# Altium schematic sheet MicroSDCard.SchDoc
size A4; Revision: C.2(PCB.SCH)
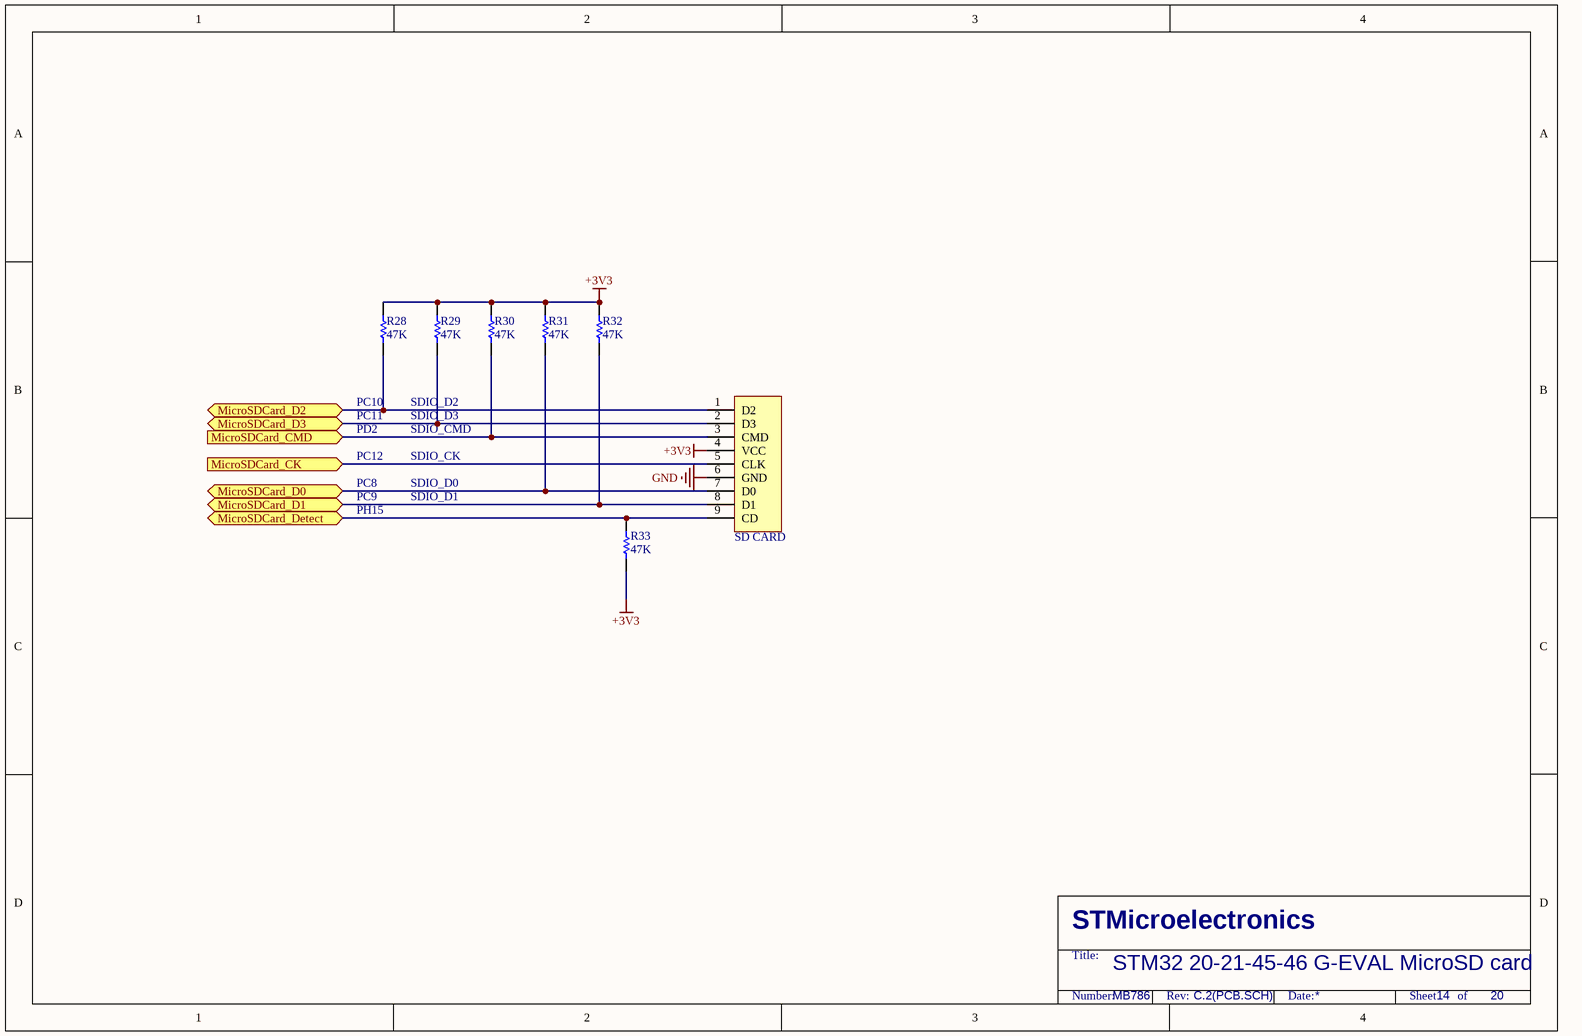
[diagram p0: MicroSDCard.SchDoc]

## Parts
R28  47K  [0603_R]
R29  47K  [0603_R]
R30  47K  [0603_R]
R31  47K  [0603_R]
R32  47K  [0603_R]
R33  47K  [0603_R]
SD_CARD  SD_Card_TF  [SD_Card_TF]  (value not drawn)

## Ports
MicroSDCard_CK (in), MicroSDCard_CMD (in), MicroSDCard_D0 (bidir), MicroSDCard_D1 (bidir), MicroSDCard_D2 (bidir), MicroSDCard_D3 (bidir), MicroSDCard_Detect

## Nets
+3V3: R28.1 R29.1 R30.1 R31.1 R32.1 R33.2 SD_CARD.4(VCC)
GND: SD_CARD.6(GND)
MicroSDCard_CK: SD_CARD.5(CLK) ; port MicroSDCard_CK
MicroSDCard_CMD: R30.2 SD_CARD.3(CMD) ; port MicroSDCard_CMD
MicroSDCard_D0: R31.2 SD_CARD.7(D0) ; port MicroSDCard_D0
MicroSDCard_D1: R32.2 SD_CARD.8(D1) ; port MicroSDCard_D1
MicroSDCard_D2: R28.2 SD_CARD.1(D2) ; port MicroSDCard_D2
MicroSDCard_D3: R29.2 SD_CARD.2(D3) ; port MicroSDCard_D3
MicroSDCard_Detect: R33.1 SD_CARD.9(CD) ; port MicroSDCard_Detect

## Notes on the sheet
- PC10
- PC11
- PD2
- SDIO_CMD
- SDIO_D3
- SDIO_D2
- PC8
- PC9
- PC12
- PH15
- SDIO_D1
- SDIO_D0
- SDIO_CK
- STM32 20-21-45-46 G-EVAL MicroSD card
- MB786
- 14
- 20
- STMicroelectronics
- Title:
- Number:
- Rev:
- Date:
- Sheet       of

## Library data of the parts
R28-R33 = Res1: Resistor; Value: 1K; Published: 8-Jun-2000; Revision: July-2002: Re-released for DXP Platform.; Publisher: Altium Limited
SD_CARD = SD_Card_TF: SD